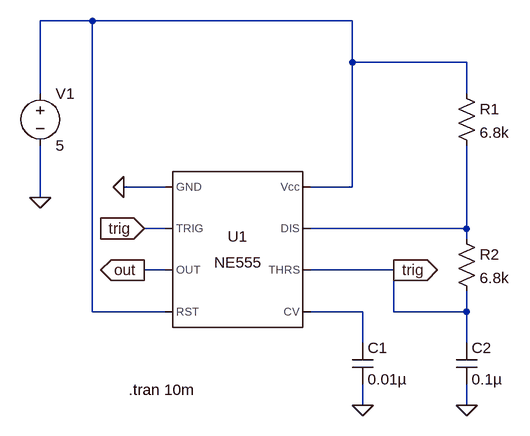
[diagram p0: schematic Astable Multivibrator.asc]
Astable Multivibrator.asc, the LTspice schematic file:
Version 4
SHEET 1 908 680
WIRE 256 32 176 32
WIRE 656 32 256 32
WIRE 656 96 656 32
WIRE 832 96 656 96
WIRE 176 144 176 32
WIRE 832 144 832 96
WIRE 368 288 304 288
WIRE 656 288 656 96
WIRE 656 288 592 288
WIRE 176 304 176 224
WIRE 368 352 336 352
WIRE 832 352 832 224
WIRE 832 352 592 352
WIRE 832 368 832 352
WIRE 368 416 336 416
WIRE 720 416 592 416
WIRE 256 480 256 32
WIRE 368 480 256 480
WIRE 672 480 592 480
WIRE 720 480 720 416
WIRE 832 480 832 448
WIRE 832 480 720 480
WIRE 672 528 672 480
WIRE 832 528 832 480
WIRE 672 624 672 592
WIRE 832 624 832 592
FLAG 304 288 0
FLAG 336 352 trig
IOPIN 336 352 In
FLAG 336 416 out
IOPIN 336 416 Out
FLAG 176 304 0
FLAG 672 624 0
FLAG 832 624 0
FLAG 720 416 trig
IOPIN 720 416 Out
SYMBOL Misc\\NE555 480 384 R0
SYMATTR InstName U1
SYMBOL voltage 176 128 R0
SYMATTR InstName V1
SYMATTR Value 5
SYMBOL cap 656 528 R0
SYMATTR InstName C1
SYMATTR Value 0.01µ
SYMBOL cap 816 528 R0
SYMATTR InstName C2
SYMATTR Value 0.1µ
SYMBOL res 816 128 R0
SYMATTR InstName R1
SYMATTR Value 6.8k
SYMBOL res 816 352 R0
SYMATTR InstName R2
SYMATTR Value 6.8k
TEXT 312 600 Left 2 !.tran 10m

The netlist it stands for:
* Astable Multivibrator.asc
XU1 0 trig out N001 N003 trig N002 N001 NE555  ; pins GND TRIG OUT RST CV THRS DIS Vcc
V1 N001 0 5
C1 N003 0 0.01µ
C2 trig 0 0.1µ
R1 N001 N002 6.8k
R2 N002 trig 6.8k
.tran 10m
.lib NE555.sub
.backanno
.end